# EAGLE design DACCACCHE_ERRARD_Schematic (EAGLE 7.7.0)
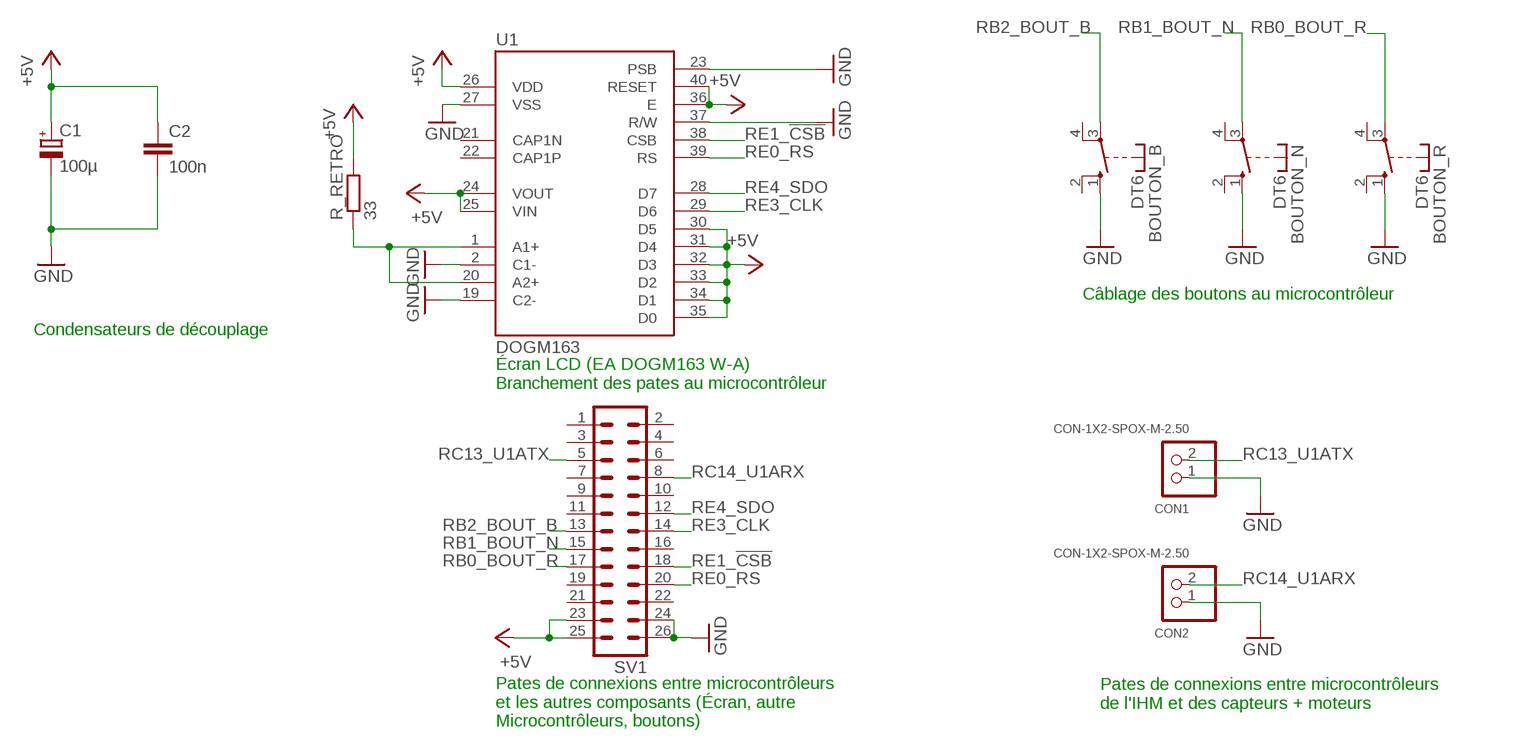
[diagram p0: schematic, sheet 1]

## Parts
BOUTON_B  DT6  [DT6]
BOUTON_N  DT6  [DT6]
BOUTON_R  DT6  [DT6]
C1  100µ  CPOL-EUE2.5-7  [E2,5-7]
C2  100n  C-EU025-025X050  [C025-025X050]
CON1  CON-1X2-SPOX-M-2.50  [SPOX-M-2.50-02]
CON2  CON-1X2-SPOX-M-2.50  [SPOX-M-2.50-02]
R_RETRO  33  R-EU_0207/15  [0207/15]
SV1  ML26  [ML26]
U1  DOGM163  [DOGM]

## Nets
+5V: C1.+ C2.1 R_RETRO.2 SV1.23 SV1.25 U1.24(VOUT) U1.25(VIN) U1.26(VDD) U1.30(D5) U1.31(D4) U1.32(D3) U1.33(D2) U1.34(D1) U1.35(D0) U1.36(E) U1.40(RESET)
GND: BOUTON_B.1(S) BOUTON_N.1(S) BOUTON_R.1(S) C1.- C2.2 CON1.1 CON2.1 SV1.24 SV1.26 U1.2(C1-) U1.19(C2-) U1.23(PSB) U1.27(VSS) U1.37(R/W)
RB0_BOUT_R: BOUTON_R.3(P) SV1.17
RB1_BOUT_N: BOUTON_N.3(P) SV1.15
RB2_BOUT_B: BOUTON_B.3(P) SV1.13
RC13_U1ATX: CON1.2 SV1.5
RC14_U1ARX: CON2.2 SV1.8
RE0_RS: SV1.20 U1.39(RS)
RE1_!CSB: SV1.18 U1.38(CSB)
RE3_CLK: SV1.14 U1.29(D6)
RE4_SDO: SV1.12 U1.28(D7)
RHETRO_RES: R_RETRO.1 U1.1(A1+) U1.20(A2+)
Unconnected: BOUTON_B.2(S) BOUTON_B.4(P) BOUTON_N.2(S) BOUTON_N.4(P) BOUTON_R.2(S) BOUTON_R.4(P) SV1.1 SV1.2 SV1.3 SV1.4 SV1.6 SV1.7 SV1.9 SV1.10 SV1.11 SV1.16 SV1.19 SV1.21 SV1.22 U1.21(CAP1N) U1.22(CAP1P)

## Notes on the sheet
- Câblage des boutons au microcontrôleur
- Condensateurs de découplage
- Écran LCD (EA DOGM163 W-A) 
  Branchement des pates au microcontrôleur
- Pates de connexions entre microcontrôleurs 
  de l'IHM et des capteurs + moteurs
- Pates de connexions entre microcontrôleurs
  et les autres composants (Écran, autre
  Microcontrôleurs, boutons)

## Library data of the parts
BOUTON_B BOUTON_N BOUTON_R = switch-misc:DT: ITT SWITCH
C1 = rcl:CPOL-EU: POLARIZED CAPACITOR, European symbol
C2 = rcl:C-EU: CAPACITOR, European symbol
CON1 CON2 = EEA0601-770-20230201:CON-1X2: Fabricant : MOLEX 22-03-5025 <http://www.molex.com/molex/products/datasheet.jsp?part=active/0022035025_PCB_HEADERS.xml> Connecteur fil-à-carte, 2.5 mm, 2 Contact(s), Embase, Série SPOX 5267, Traversant, 1 Rangée(s) Distributeurs : RS : 687-8045 <http://fr.rs-online.com/web/p/embases-de-circuit-imprime/6878045/?sra=pstk> Farnell : 9979611 <http://fr.farnell.com/molex/22-03-5025/boitier-vertical-2-5mm-2voies/dp/9979611>
R_RETRO = rcl:R-EU_: RESISTOR, European symbol
SV1 = EEA0601-770-20170216:ML26: HARTING; OC_FARNELL: unknown; OC_NEWARK: unknown
U1 = EEA0601-770-20170216:DOGM163

## Board
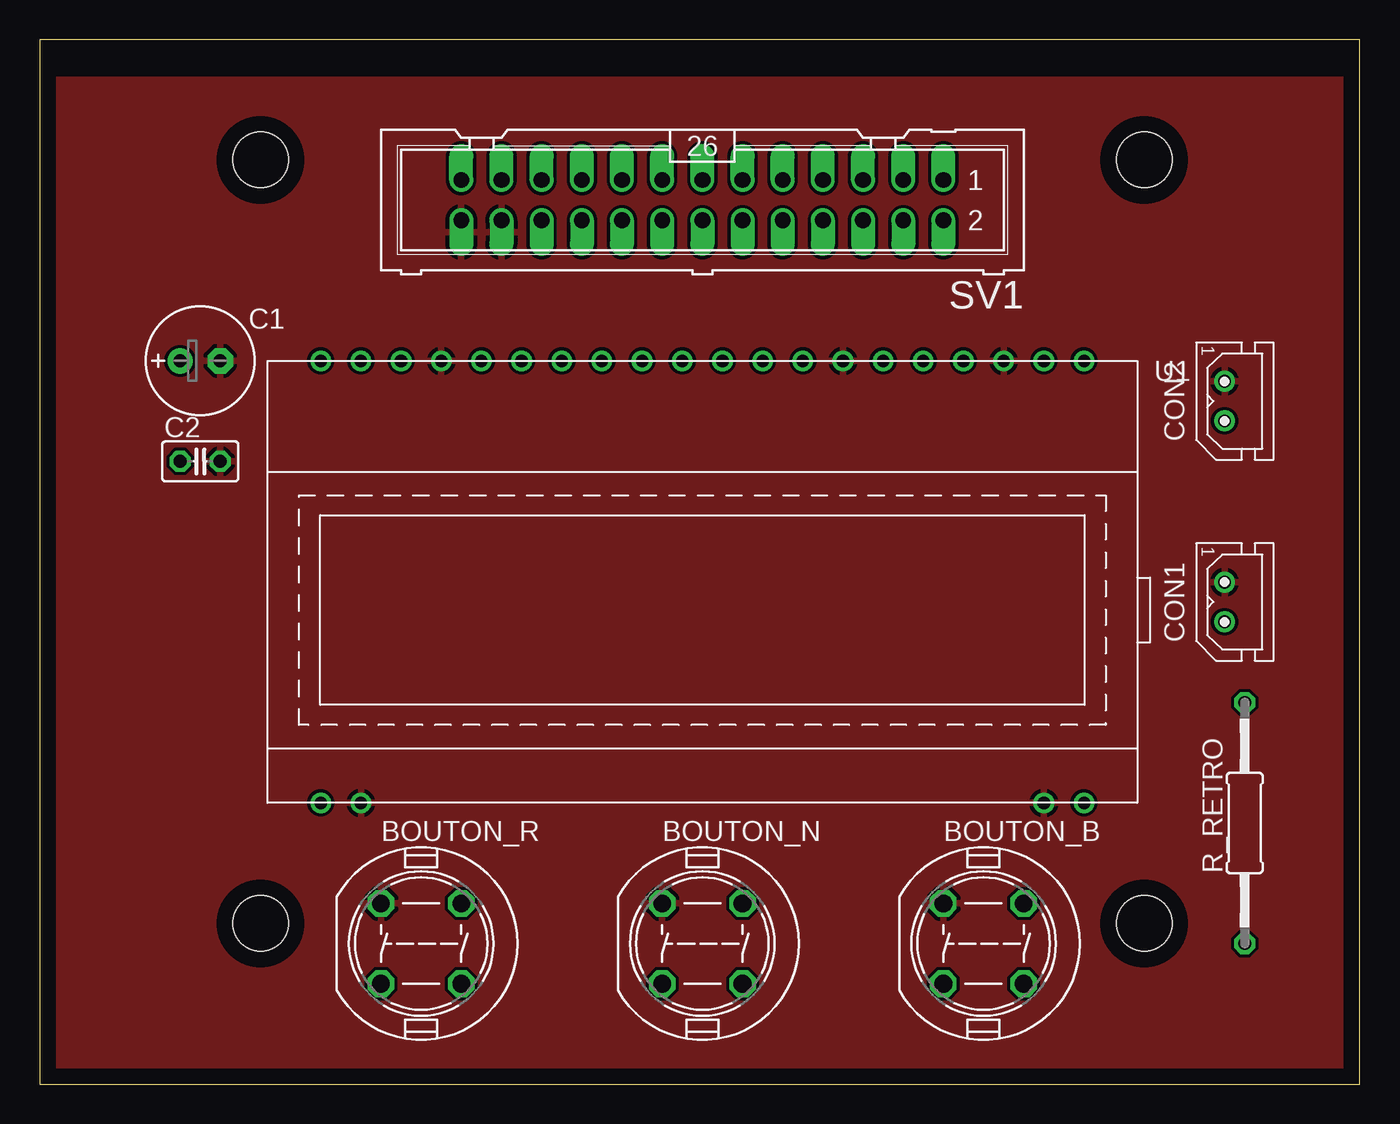
[diagram p1: board, top side]
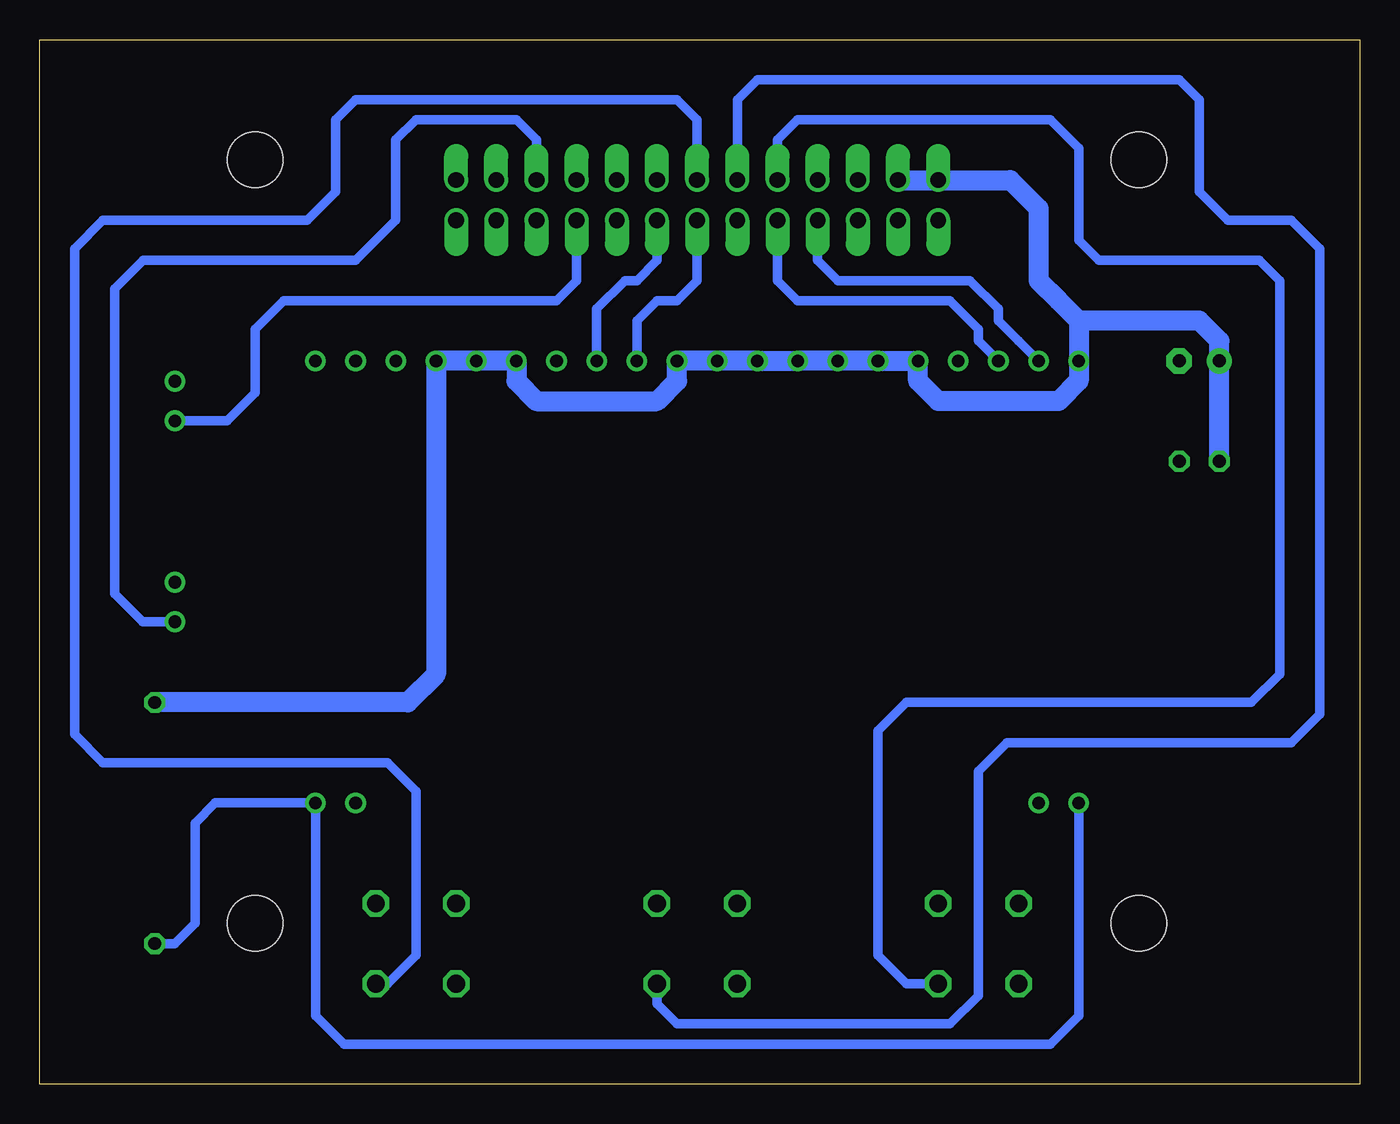
[diagram p2: board, bottom side, seen from below]

Size 83.49 x 66.03 mm. Coordinates in mm from the lower left corner, seen from the top.
Outline: 0,0 83.49,0 83.49,66.03 0,66.03 0,0
Copper layers (1*16): Top 0.035mm / dielectric 1.5mm / Bottom 0.035mm
Design rules "default": minimum track width 10mil, minimum drill 24mil, track to track 8mil, track to pad 8mil, pad to pad 8mil, via to via 8mil, smd to smd 8mil, copper to edge 40mil, drill to drill 8mil, minimum pad ring 10mil, minimum via ring 8mil, stop-mask expansion 4mil, vias tented up to drill 0mil, thermal gap 10mil
Holes 3.5 mm at 13.97,58.42 69.85,58.42 13.97,10.16 69.85,10.16

### Footprints (pad centres in the part's own frame; a part is rotated, then mirrored left to right if it is on the bottom)
DT6 = drill 1.118 octagon: 1 -2.54,2.54; 2 2.54,2.54; 3 2.54,-2.54; 4 -2.54,-2.54
E2,5-7 = drill 0.813 pad 1.6: + -1.27,0 | drill 0.813 pad 1.6 octagon: - 1.27,0
C025-025X050 = drill 0.813 octagon: 1 -1.27,0; 2 1.27,0
SPOX-M-2.50-02 = drill 0.8: 1 1.25,0; 2 -1.25,0
0207/15 = drill 0.813 octagon: 1 -7.62,0; 2 7.62,0
ML26 = drill 1 offset: 1 -15.24,-1.27; 2 -15.24,1.27; 3 -12.7,-1.27; 4 -12.7,1.27; 5 -10.16,-1.27; 6 -10.16,1.27; 7 -7.62,-1.27; 8 -7.62,1.27; 9 -5.08,-1.27; 10 -5.08,1.27; 11 -2.54,-1.27; 12 -2.54,1.27; 13 0,-1.27; 14 0,1.27; 15 2.54,-1.27; 16 2.54,1.27; 17 5.08,-1.27; 18 5.08,1.27; 19 7.62,-1.27; 20 7.62,1.27; 21 10.16,-1.27; 22 10.16,1.27; 23 12.7,-1.27; 24 12.7,1.27; 25 15.24,-1.27; 26 15.24,1.27
DOGM = drill 0.8: 1 -24.13,-12.7; 2 -21.59,-12.7; 19 21.59,-12.7; 20 24.13,-12.7; 21 24.13,15.24; 22 21.59,15.24; 23 19.05,15.24; 24 16.51,15.24; 25 13.97,15.24; 26 11.43,15.24; 27 8.89,15.24; 28 6.35,15.24; 29 3.81,15.24; 30 1.27,15.24; 31 -1.27,15.24; 32 -3.81,15.24; 33 -6.35,15.24; 34 -8.89,15.24; 35 -11.43,15.24; 36 -13.97,15.24; 37 -16.51,15.24; 38 -19.05,15.24; 39 -21.59,15.24; 40 -24.13,15.24

### Placement (x,y rotation side)
BOUTON_B  59.69,8.89 0 top
BOUTON_N  41.91,8.89 0 top
BOUTON_R  24.13,8.89 0 top
C1  10.16,45.72 0 top
C2  10.16,39.37 0 top
CON1  74.93,30.48 90 top
CON2  74.93,43.18 90 top
R_RETRO  76.2,16.51 90 top
SV1  41.91,55.88 180 top
U1  41.91,30.48 0 top

### Tracks (layer width: path | path; a pad name or v marks a point on that pad's centre or on a via)
+5V
  Bottom 1.27: C2.1 C1.+ 8.89,46.99 10.16,48.26 17.78,48.26 | R_RETRO.2 60.22,24.13 58.42,25.93 U1.24 U1.25 U1.26 53.34,44.45 52.07,43.18 44.45,43.18 43.18,44.45 U1.30 U1.31 U1.32 U1.33 U1.34 U1.35 U1.36 27.94,44.45 26.67,43.18 19.05,43.18 17.78,44.45 U1.40 17.78,48.26 | SV1.25 SV1.23 22.12,57.15 20.32,55.35 20.32,50.8 19.05,49.53 17.78,48.26
GND
  pour Top: -6.35,63.5 88.9,63.5 88.9,-12.7 -6.35,-12.7
RB0_BOUT_R
  Bottom 0.61: SV1.17 36.83,59.69 35.56,60.96 19.58,60.96 17.78,59.16 17.78,53.34 16.51,52.07 6.35,52.07 5.08,50.8 5.08,25.93 6.88,24.13 28.68,24.13 30.48,22.33 30.48,8.15 28.68,6.35 BOUTON_R.3
RB1_BOUT_N
  Bottom 0.61: SV1.15 39.37,62.23 38.1,63.5 11.43,63.5 10.16,62.23 10.16,56.41 8.36,54.61 4.34,54.61 2.54,52.81 2.54,23.39 4.34,21.59 22.33,21.59 24.13,19.79 24.13,5.61 25.93,3.81 43.18,3.81 44.45,5.08 BOUTON_N.3
RB2_BOUT_B
  Bottom 0.61: SV1.13 41.91,60.96 43.18,62.23 63.5,62.23 64.77,60.96 64.77,56.41 66.57,54.61 79.48,54.61 81.28,52.81 81.28,22.12 79.48,20.32 61.49,20.32 59.69,18.52 59.69,8.15 61.49,6.35 BOUTON_B.3
RC13_U1ATX
  Bottom 0.61: CON1.2 76.96,29.23 78.74,31.01 78.74,50.27 76.94,52.07 63.5,52.07 60.96,54.61 60.96,59.69 59.69,60.96 53.34,60.96 52.07,59.69 SV1.5
RC14_U1ARX
  Bottom 0.61: CON2.2 71.63,41.93 69.85,43.71 69.85,47.73 68.05,49.53 50.8,49.53 49.53,50.8 SV1.8
RE0_RS
  Bottom 0.61: U1.39 21.59,46.99 22.86,48.26 22.86,49 24.66,50.8 33.02,50.8 34.29,52.07 SV1.20
RE1_!CSB
  Bottom 0.61: SV1.18 36.83,50.8 35.56,49.53 25.93,49.53 24.13,47.73 24.13,46.99 U1.38
RE3_CLK
  Bottom 0.61: U1.29 45.72,48.26 44.45,49.53 43.18,49.53 41.91,50.8 SV1.14
RE4_SDO
  Bottom 0.61: U1.28 48.26,49 46.46,50.8 45.72,50.8 44.45,52.07 SV1.12
RHETRO_RES
  Bottom 0.61: R_RETRO.1 74.93,8.89 73.66,10.16 73.66,16.51 72.39,17.78 U1.20 66.04,4.34 64.24,2.54 19.58,2.54 17.78,4.34 U1.1